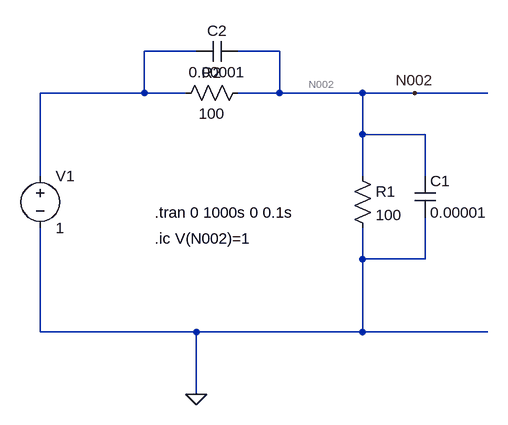
[diagram p0: schematic Q5.asc]
Q5.asc, the LTspice schematic file:
Version 4
SHEET 1 880 680
WIRE 352 64 272 64
WIRE 480 64 416 64
WIRE 272 128 272 64
WIRE 272 128 112 128
WIRE 336 128 272 128
WIRE 480 128 480 64
WIRE 480 128 416 128
WIRE 608 128 480 128
WIRE 688 128 608 128
WIRE 800 128 688 128
WIRE 608 192 608 128
WIRE 704 192 608 192
WIRE 112 256 112 128
WIRE 608 256 608 192
WIRE 704 256 704 192
WIRE 608 384 608 336
WIRE 704 384 704 320
WIRE 704 384 608 384
WIRE 112 496 112 336
WIRE 352 496 112 496
WIRE 608 496 608 384
WIRE 608 496 352 496
WIRE 800 496 608 496
WIRE 352 592 352 496
FLAG 352 592 0
FLAG 688 128 N002
SYMBOL voltage 112 240 R0
SYMATTR InstName V1
SYMATTR Value 1
SYMBOL res 592 240 R0
SYMATTR InstName R1
SYMATTR Value 100
SYMBOL res 432 112 R90
WINDOW 0 0 56 VBottom 2
WINDOW 3 32 56 VTop 2
SYMATTR InstName R2
SYMATTR Value 100
SYMBOL cap 688 256 R0
SYMATTR InstName C1
SYMATTR Value 0.00001
SYMBOL cap 416 48 R90
WINDOW 0 0 32 VBottom 2
WINDOW 3 32 32 VTop 2
SYMATTR InstName C2
SYMATTR Value 0.00001
TEXT 288 312 Left 2 !.tran 0 1000s 0 0.1s
TEXT 288 352 Left 2 !.ic V(N002)=1

The netlist it stands for:
* Q5.asc
V1 N001 0 1
R1 N002 0 100
R2 N002 N001 100
C1 N002 0 0.00001
C2 N002 N001 0.00001
.tran 0 1000s 0 0.1s
.ic V(N002)=1
.backanno
.end